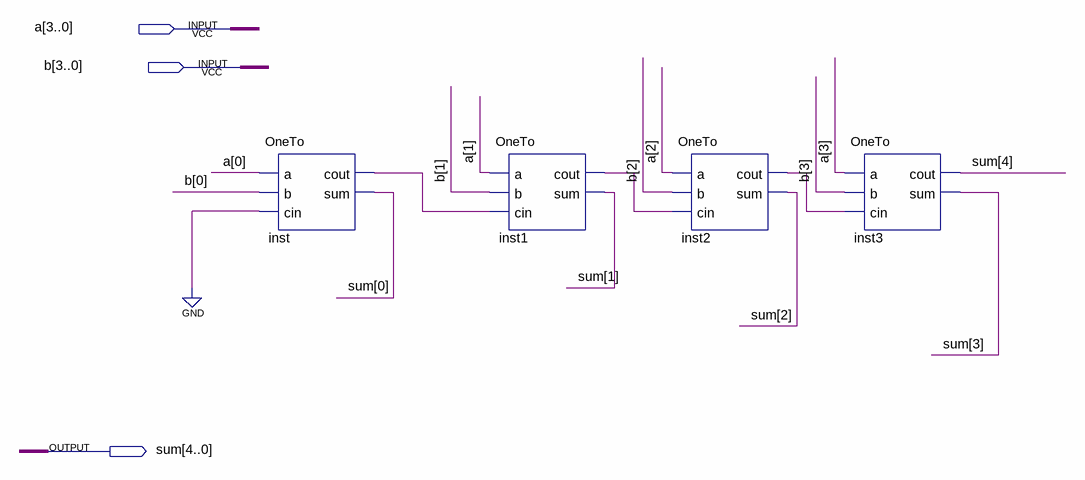
[diagram p0: schematic sheet]
// Quartus schematic Block1.bdf as structural Verilog: 4 symbols, 3 pins
module Block1 (
  input  [3:0] a,
  input  [3:0] b,
  output [4:0] sum
);

  wire inst1_cout, inst2_cout, inst_cout;

  OneTo inst (.a(a[0]), .b(b[0]), .cin(1'b0), .cout(inst_cout), .sum(sum[0]));
  OneTo inst1 (.a(a[1]), .b(b[1]), .cin(inst_cout), .cout(inst1_cout), .sum(sum[1]));
  OneTo inst2 (.a(a[2]), .b(b[2]), .cin(inst1_cout), .cout(inst2_cout), .sum(sum[2]));
  OneTo inst3 (.a(a[3]), .b(b[3]), .cin(inst2_cout), .cout(sum[4]), .sum(sum[3]));
endmodule
